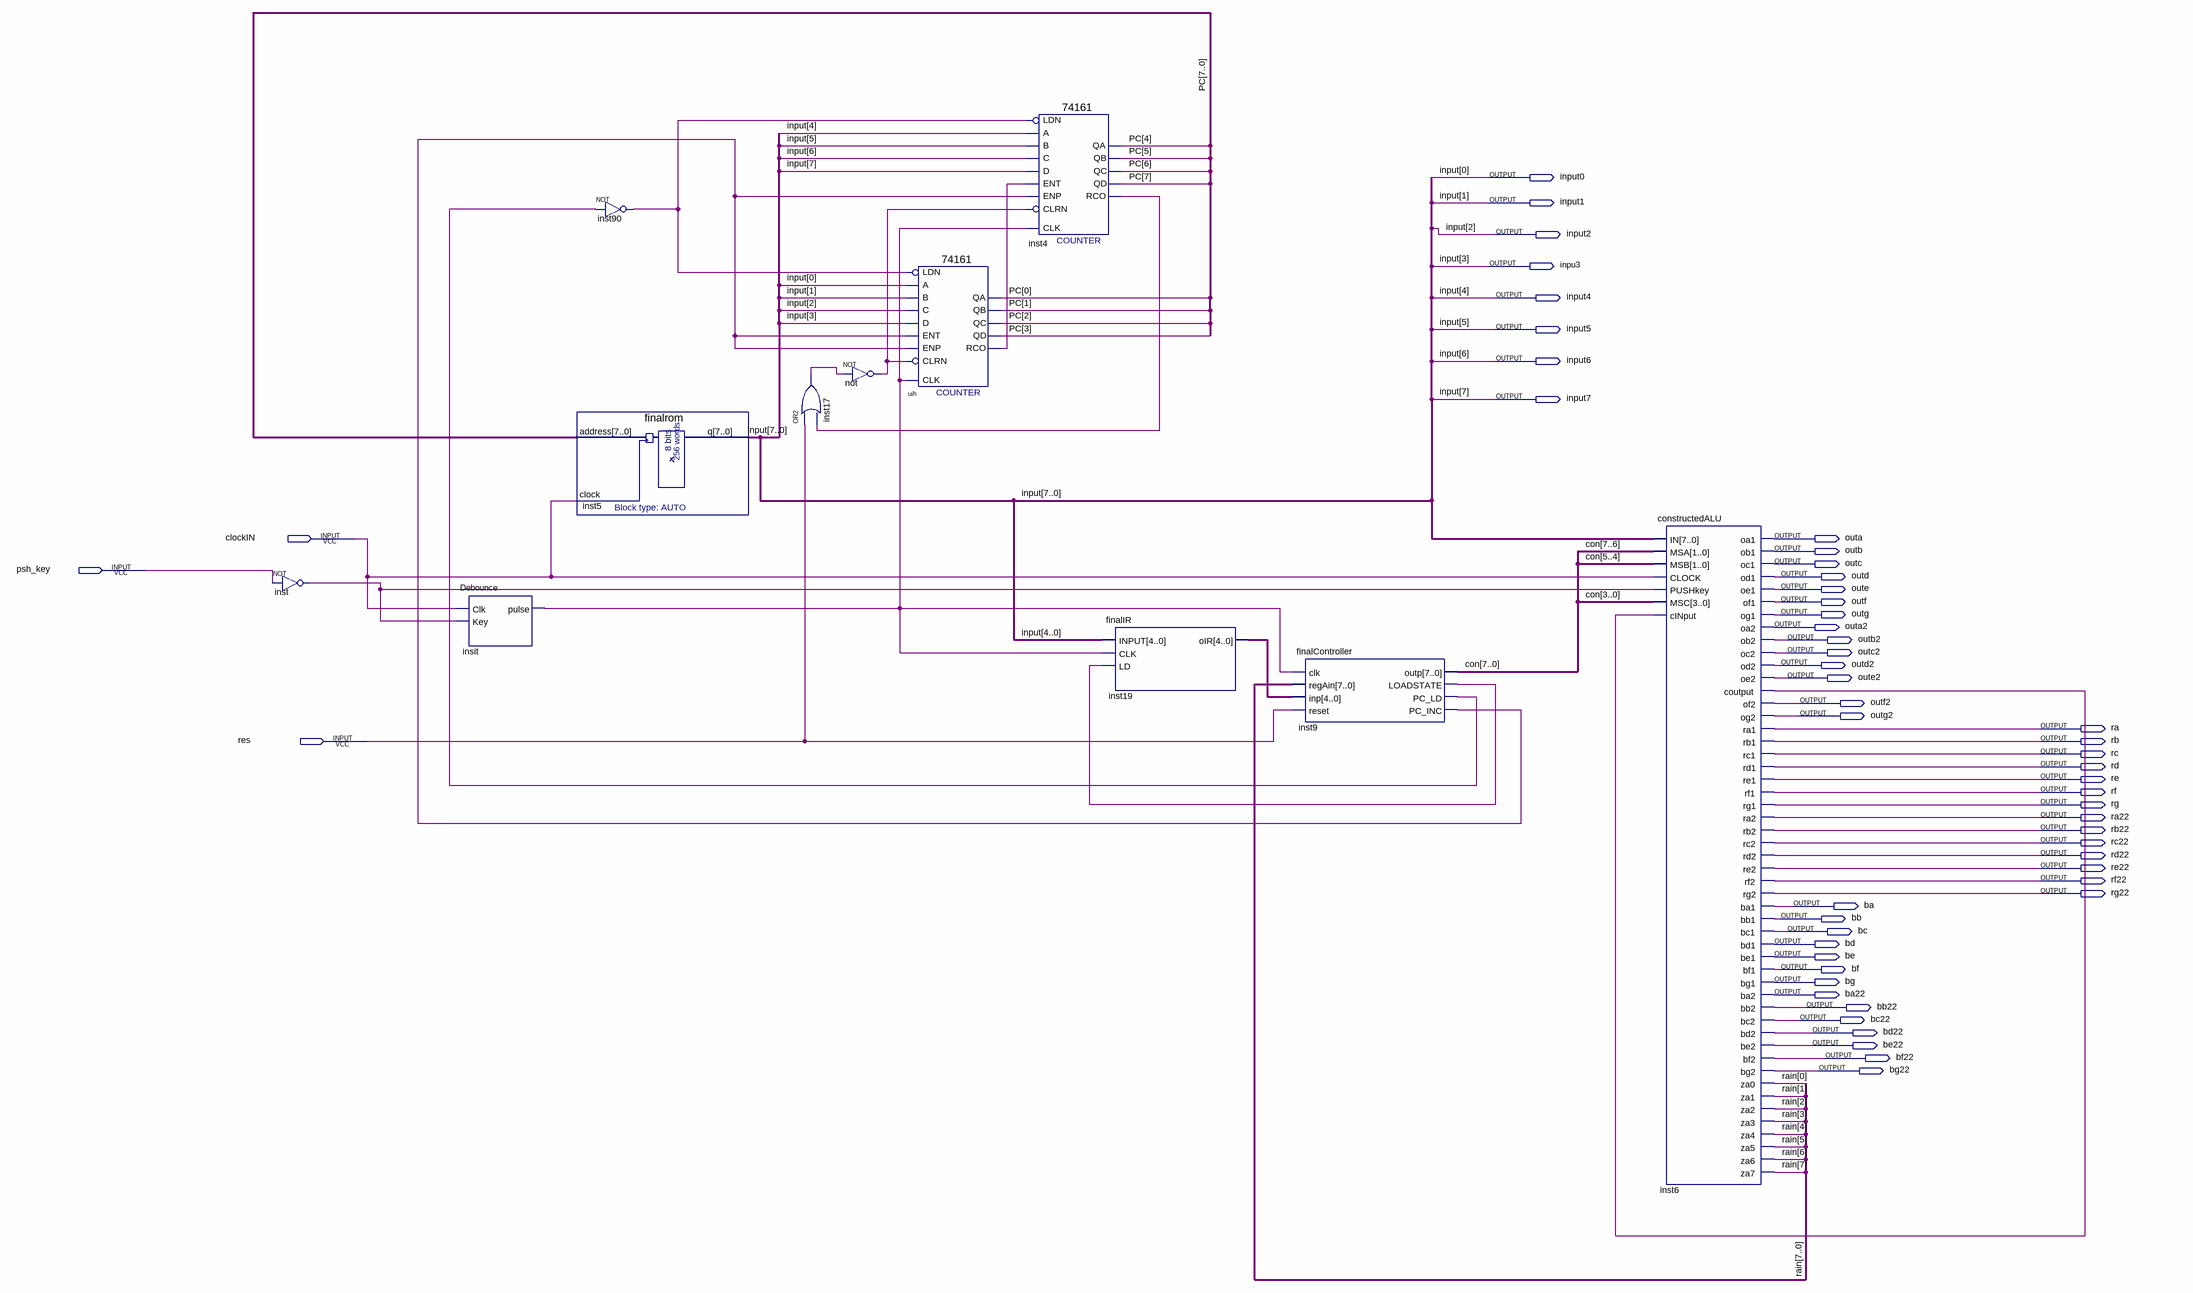
[diagram p0: schematic sheet]
// Quartus schematic finalCPU.bdf as structural Verilog: 11 symbols, 53 pins
module finalCPU (
  input  clockIN,
  input  psh_key,
  input  res,
  output input0,
  output input1,
  output input2,
  output inpu3,
  output input4,
  output input5,
  output input6,
  output input7,
  output outa,
  output outb,
  output outc,
  output outd,
  output oute,
  output outf,
  output outg,
  output outa2,
  output outb2,
  output outc2,
  output outd2,
  output oute2,
  output outf2,
  output outg2,
  output ra,
  output rb,
  output rc,
  output rd,
  output re,
  output rf,
  output rg,
  output ra22,
  output rb22,
  output rc22,
  output rd22,
  output re22,
  output rf22,
  output rg22,
  output ba,
  output bb,
  output bc,
  output bd,
  output be,
  output bf,
  output bg,
  output ba22,
  output bb22,
  output bc22,
  output bd22,
  output be22,
  output bf22,
  output bg22
);

  wire insit_pulse, inst4_rco, inst6_coutput, inst9_loadstate, inst9_pc_inc, inst9_pc_ld, inst17_out,
       inst90_out, inst_out, not_out, uih_rco;
  wire [4:0] inst19_oir;
  wire [7:0] con, PC, rain;

  not inst (inst_out, psh_key);
  Debounce insit (.Clk(clockIN), .Key(inst_out), .pulse(insit_pulse));
  not inst90 (inst90_out, inst9_pc_ld);
  finalrom inst5 (.address(PC), .clock(clockIN), .q({input7, input6, input5, input4, inpu3, input2, input1, input0}));
  or inst17 (inst17_out, res, inst4_rco);
  not \not  (not_out, inst17_out);
  \74161  uih (
    .CLRN(not_out), .CLK(insit_pulse), .ENP(inst9_pc_inc), .LDN(inst90_out), .A(input0), .D(inpu3),
    .ENT(inst9_pc_inc), .B(input1), .C(input2), .QD(PC[3]), .QC(PC[2]), .QB(PC[1]), .QA(PC[0]), .RCO(uih_rco));
  \74161  inst4 (
    .CLRN(not_out), .CLK(insit_pulse), .ENP(inst9_pc_inc), .LDN(inst90_out), .A(input4), .D(input7),
    .ENT(uih_rco), .B(input5), .C(input6), .QD(PC[7]), .QC(PC[6]), .QB(PC[5]), .QA(PC[4]), .RCO(inst4_rco));
  finalIR inst19 (
    .INPUT({input4, inpu3, input2, input1, input0}), .CLK(insit_pulse), .LD(inst9_loadstate), .oIR(inst19_oir));
  finalController inst9 (
    .clk(insit_pulse), .regAin(rain), .inp(inst19_oir), .reset(res), .outp(con), .LOADSTATE(inst9_loadstate),
    .PC_LD(inst9_pc_ld), .PC_INC(inst9_pc_inc));
  constructedALU inst6 (
    .IN({input7, input6, input5, input4, inpu3, input2, input1, input0}), .MSA(con[7:6]), .MSB(con[5:4]),
    .CLOCK(clockIN), .PUSHkey(inst_out), .MSC(con[3:0]), .cINput(inst6_coutput), .oa1(outa), .ob1(outb),
    .oc1(outc), .od1(outd), .oe1(oute), .of1(outf), .og1(outg), .oa2(outa2), .ob2(outb2), .oc2(outc2),
    .od2(outd2), .oe2(oute2), .coutput(inst6_coutput), .of2(outf2), .og2(outg2), .ra1(ra), .rb1(rb),
    .rc1(rc), .rd1(rd), .re1(re), .rf1(rf), .rg1(rg), .ra2(ra22), .rb2(rb22), .rc2(rc22), .rd2(rd22),
    .re2(re22), .rf2(rf22), .rg2(rg22), .ba1(ba), .bb1(bb), .bc1(bc), .bd1(bd), .be1(be), .bf1(bf), .bg1(bg),
    .ba2(ba22), .bb2(bb22), .bc2(bc22), .bd2(bd22), .be2(be22), .bf2(bf22), .bg2(bg22), .za0(rain[0]),
    .za1(rain[1]), .za2(rain[2]), .za3(rain[3]), .za4(rain[4]), .za5(rain[5]), .za6(rain[6]), .za7(rain[7]));

  // Other names for the same wires on the sheet: input[3] = inpu3
endmodule
